# EAGLE design dash-board (EAGLE 4.16)
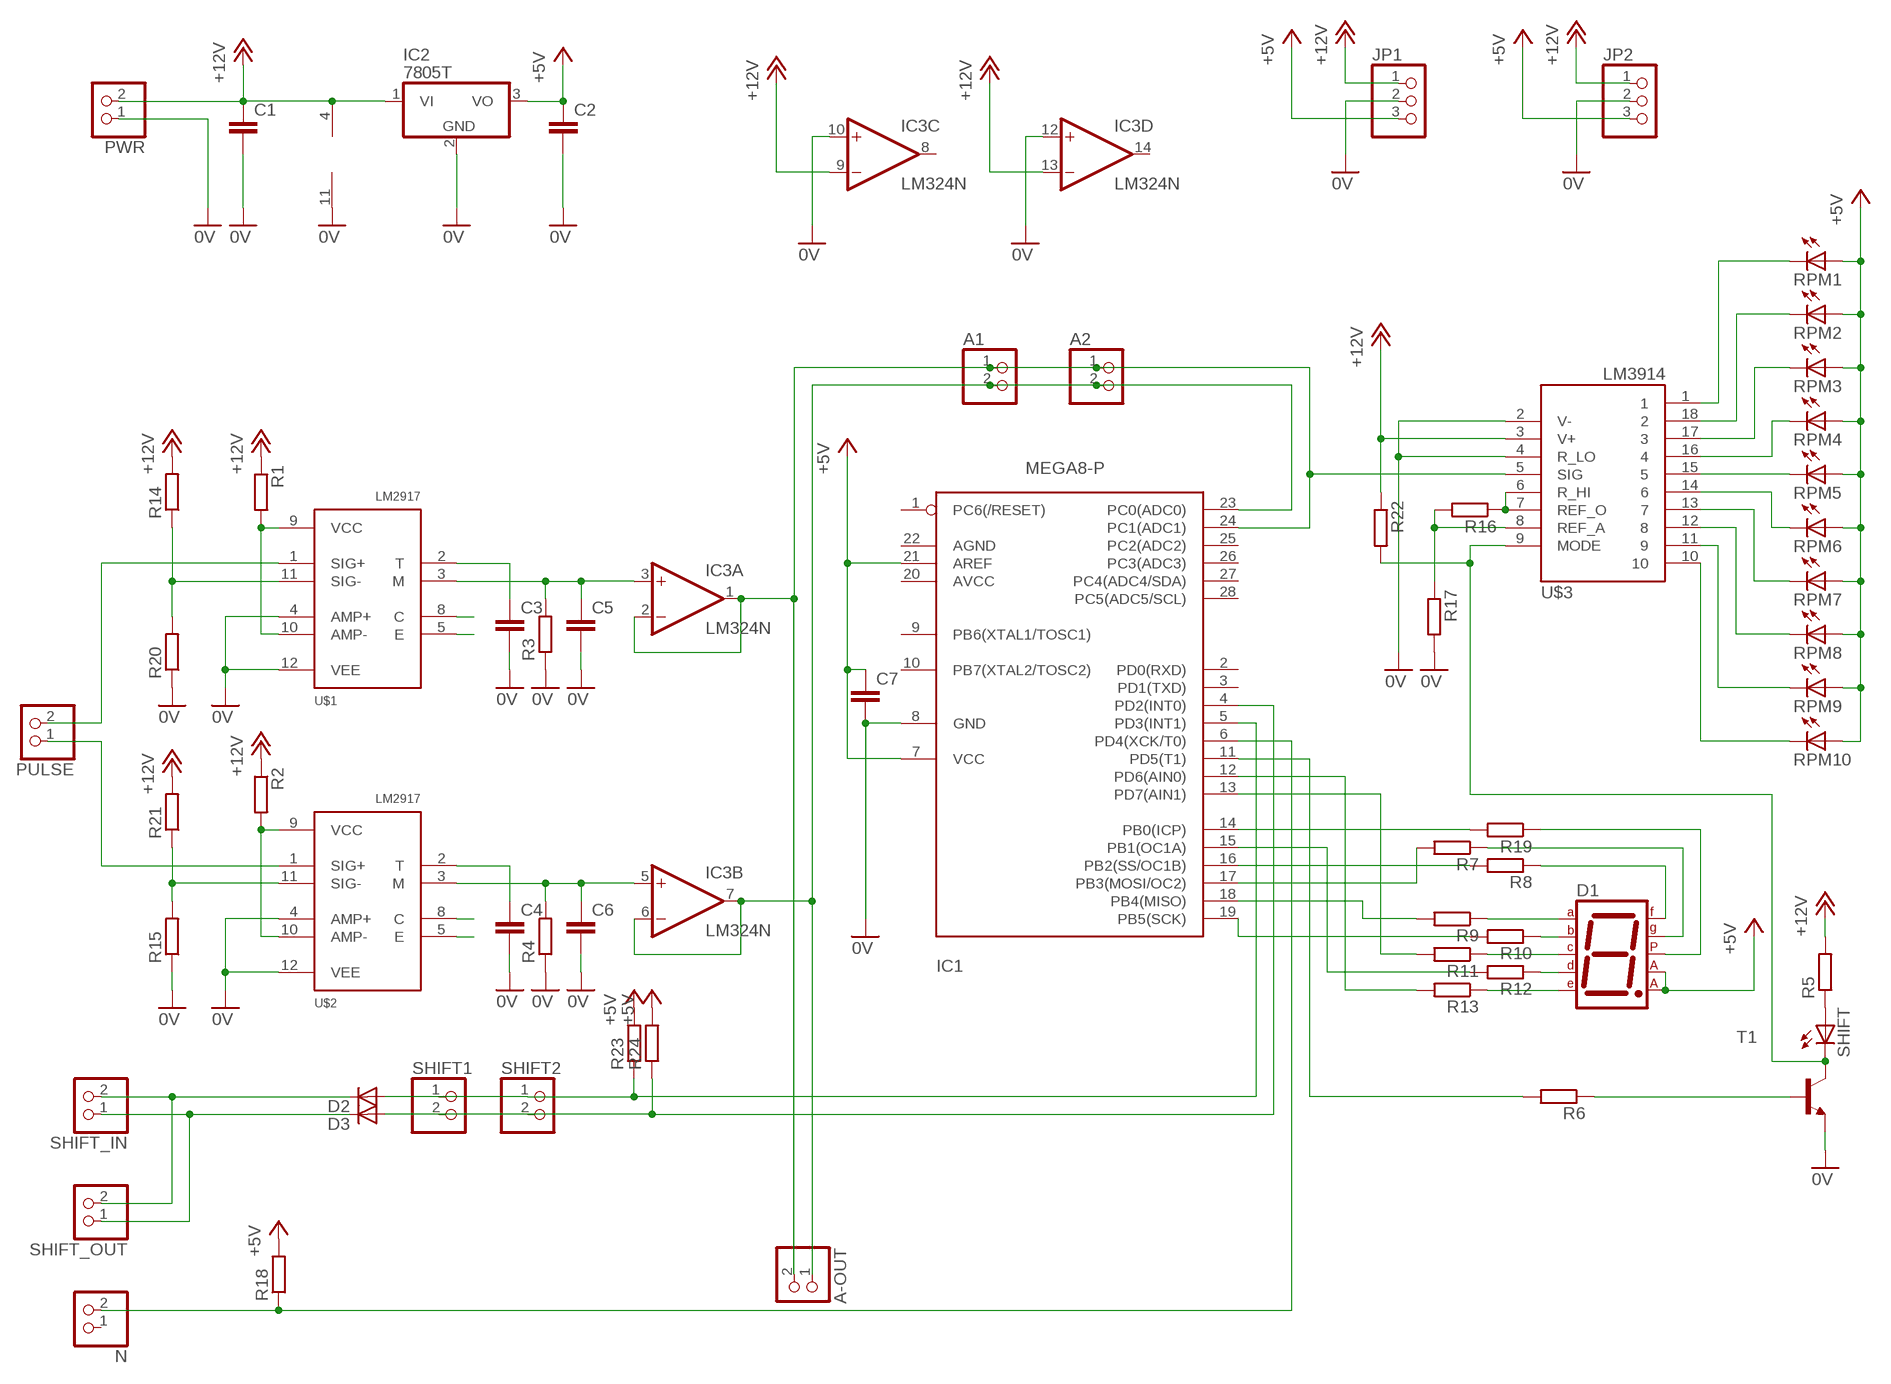
[diagram p0: schematic, sheet 1]

## Parts
A1  PINHD-1X2  [1X02]
A2  PINHD-1X2  [1X02]
A-OUT  PINHD-1X2  [1X02]
C1  C-EU050-025X075  [C050-025X075]
C2  C-EU050-025X075  [C050-025X075]
C3  C-EU050-025X075  [C050-025X075]
C4  C-EU050-025X075  [C050-025X075]
C5  C-EU050-025X075  [C050-025X075]
C6  C-EU050-025X075  [C050-025X075]
C7  C-EU050-025X075  [C050-025X075]
D1  7SEG-CA  [7SEG-13]
D2  DIODE-D-5  [D-5]
D3  DIODE-D-5  [D-5]
IC1  MEGA8-P  [DIL28-3]
IC2  7805T  [TO220H]
IC3  LM324N  [DIL14]
JP1  PINHD-1X3  [1X03]
JP2  PINHD-1X3  [1X03]
N  PINHD-1X2  [1X02]
PULSE  PINHD-1X2  [1X02]
PWR  PINHD-1X2  [1X02]
R1  R-EU_0204/7  [0204/7]
R2  R-EU_0204/7  [0204/7]
R3  R-EU_0204/7  [0204/7]
R4  R-EU_0204/7  [0204/7]
R5  R-EU_0204/7  [0204/7]
R6  R-EU_0204/7  [0204/7]
R7  R-EU_0204/7  [0204/7]
R8  R-EU_0204/7  [0204/7]
R9  R-EU_0204/7  [0204/7]
R10  R-EU_0204/7  [0204/7]
R11  R-EU_0204/7  [0204/7]
R12  R-EU_0204/7  [0204/7]
R13  R-EU_0204/7  [0204/7]
R14  R-EU_0204/7  [0204/7]
R15  R-EU_0204/7  [0204/7]
R16  R-EU_0204/7  [0204/7]
R17  R-EU_0204/7  [0204/7]
R18  R-EU_0204/7  [0204/7]
R19  R-EU_0204/7  [0204/7]
R20  R-EU_0204/7  [0204/7]
R21  R-EU_0204/7  [0204/7]
R22  R-EU_0204/7  [0204/7]
R23  R-EU_0204/7  [0204/7]
R24  R-EU_0204/7  [0204/7]
RPM1  LED3MM  [LED3MM]
RPM2  LED3MM  [LED3MM]
RPM3  LED3MM  [LED3MM]
RPM4  LED3MM  [LED3MM]
RPM5  LED3MM  [LED3MM]
RPM6  LED3MM  [LED3MM]
RPM7  LED3MM  [LED3MM]
RPM8  LED3MM  [LED3MM]
RPM9  LED3MM  [LED3MM]
RPM10  LED3MM  [LED3MM]
SHIFT  LED5MM  [LED5MM]
SHIFT1  PINHD-1X2  [1X02]
SHIFT2  PINHD-1X2  [1X02]
SHIFT_IN  PINHD-1X2  [1X02]
SHIFT_OUT  PINHD-1X2  [1X02]
T1  BC547B-NPN-TO92-EBC  [TO92-EBC]
U$1  LM2917  [DIL14]
U$2  LM2917  [DIL14]
U$3  LM3914  [DIL18]

## Nets
0V: C1.2 C2.2 C3.2 C4.2 C5.2 C6.2 C7.2 IC1.8(GND) IC2.2(GND) IC3.10(C:+IN) IC3.11(P:V-) IC3.12(D:+IN) JP1.2 JP2.2 PWR.1 R3.1 R4.1 R15.1 R17.2 R20.1 T1.E U$1.4(AMP+) U$1.12(VEE) U$2.4(AMP+) U$2.12(VEE) U$3.2(V-) U$3.4(R_LO)
+5V: C2.1 C7.1 D1.3(CA1) D1.8(CA2) IC1.7(VCC) IC1.21(AREF) IC2.3(VO) JP1.3 JP2.3 R18.2 R23.2 R24.2 RPM1.A RPM2.A RPM3.A RPM4.A RPM5.A RPM6.A RPM7.A RPM8.A RPM9.A RPM10.A
+12V: C1.1 IC2.1(VI) IC3.4(P:V+) IC3.9(C:-IN) IC3.13(D:-IN) JP1.1 JP2.1 PWR.2 R1.1 R2.1 R5.2 R14.2 R21.2 R22.1 U$3.3(V+)
N$1: PULSE.2 U$1.1(SIG+)
N$2: R1.2 U$1.9(VCC) U$1.10(AMP-)
N$3: R2.2 U$2.9(VCC) U$2.10(AMP-)
N$4: RPM1.K(C) U$3.1
N$5: RPM2.K(C) U$3.18
N$6: RPM3.K(C) U$3.17
N$7: RPM4.K(C) U$3.16
N$8: RPM5.K(C) U$3.15
N$9: RPM6.K(C) U$3.14
N$10: RPM7.K(C) U$3.13
N$11: RPM8.K(C) U$3.12
N$12: RPM9.K(C) U$3.11
N$13: RPM10.K(C) U$3.10
N$14: C3.1 U$1.2(T)
N$15: C4.1 U$2.2(T)
N$16: C6.1 IC3.5(B:+IN) R4.2 U$2.3(M)
N$17: C5.1 IC3.3(A:+IN) R3.2 U$1.3(M)
N$18: D1.10(G) R7.1
N$19: PULSE.1 U$2.1(SIG+)
N$20: R22.2 SHIFT.K(C) T1.C U$3.9(MODE)
N$21: R5.1 SHIFT.A
N$22: R6.1 T1.B
N$23: U$1.8(C)
N$24: D1.9(F) R8.1
N$25: D1.7(A) R9.1
N$26: D1.6(B) R10.1
N$27: D1.4(C) R11.1
N$28: D1.2(D) R12.1
N$29: D1.1(E) R13.1
N$30: IC1.19(PB5(SCK)) R10.2
N$31: IC1.18(PB4(MISO)) R9.2
N$32: IC1.17(PB3(MOSI/OC2)) R7.2
N$33: IC1.16(PB2(SS/OC1B)) R8.2
N$34: IC1.15(PB1(OC1A)) R12.2
N$35: IC1.12(PD6(AIN0)) R13.2
N$36: IC1.13(PD7(AIN1)) R11.2
N$37: A1.1 A2.1 A-OUT.2 IC1.24(PC1(ADC1)) IC3.1(A:OUT) IC3.2(A:-IN) U$3.5(SIG)
N$38: A1.2 A2.2 A-OUT.1 IC1.23(PC0(ADC0)) IC3.6(B:-IN) IC3.7(B:OUT)
N$39: D2.C SHIFT_IN.2 SHIFT_OUT.2
N$40: D3.A IC1.4(PD2(INT0)) R24.1 SHIFT1.2 SHIFT2.2
N$41: IC1.11(PD5(T1)) R6.2
N$42: R14.1 R20.2 U$1.11(SIG-)
N$43: R16.1 U$3.6(R_HI) U$3.7(REF_O)
N$44: R16.2 R17.1 U$3.8(REF_A)
N$45: D1.5(DP) R19.1
N$46: IC1.14(PB0(ICP)) R19.2
N$47: IC1.6(PD4(XCK/T0)) N.2 R18.1
N$50: U$2.8(C)
N$51: U$2.5(E)
N$52: U$1.5(E)
N$53: R15.2 R21.1 U$2.11(SIG-)
N$65: D2.A IC1.5(PD3(INT1)) R23.1 SHIFT1.1 SHIFT2.1
N$67: SHIFT_IN.1 SHIFT_OUT.1
Unconnected: D3.C IC1.1(PC6(/RESET)) IC1.2(PD0(RXD)) IC1.3(PD1(TXD)) IC1.9(PB6(XTAL1/TOSC1)) IC1.10(PB7(XTAL2/TOSC2)) IC1.20(AVCC) IC1.22(AGND) IC1.25(PC2(ADC2)) IC1.26(PC3(ADC3)) IC1.27(PC4(ADC4/SDA)) IC1.28(PC5(ADC5/SCL)) IC3.8(C:OUT) IC3.14(D:OUT) N.1

## Library data of the parts
A1 A2 A-OUT N PULSE PWR SHIFT1 SHIFT2 SHIFT_IN SHIFT_OUT = pinhead:PINHD-1X2: PIN HEADER
C1-C7 = rcl:C-EU: CAPACITOR, European symbol
D1 = special:7SEG-CA: 7-segment DISPLAY single anode, 13 mm
D2 D3 = diode:DIODE-: DIODE
IC1 = atmel:MEGA8-P: MICROCONTROLLER 8 Kbytes FLASH 1 kbytes SRAM 512 bytes EEPROM USART 4-channel 10 bit ADC 2-channel 8 bit ADC Source: avr.lbr
IC2 = linear:78*: Positive VOLTAGE REGULATOR Source: http://cache.national.com/ds/LM/LM78L05.pdf http://www.fairchildsemi.com/ds/LM/LM7805.pdf
IC3 = linear:LM324: OP AMP
JP1 JP2 = pinhead:PINHD-1X3: PIN HEADER
R1-R24 = rcl:R-EU_: RESISTOR, European symbol
RPM1-RPM10 SHIFT = led:LED: LED OSRAM: - CHIPLED LG R971, LG N971, LY N971, LG Q971, LY Q971, LO R971, LY R971 LH N974, LH R974 LS Q976, LO Q976, LY Q976 LO Q996 - Hyper CHIPLED LW Q18S LB Q993, LB Q99A, LB R99A - SideLED LS A670, LO A670, LY A670, LG A670, LP A670 LB A673, LV A673, LT A673, LW A673 LH A674 LY A675 LS A676, LA A676, LO A676, LY A676, LW A676 LS A679, LY A679, LG A679 - Hyper Micro SIDELED® LS Y876, LA Y876, LO Y876, LY Y876 LT Y87S - SmartLED LW L88C, LW L88S LB L89C, LB L89S, LG L890 LS L89K, LO L89K, LY L89K LS L896, LA L896, LO L896, LY L896 - TOPLED LS T670, LO T670, LY T670, LG T670, LP T670 LSG T670, LSP T670, LSY T670, LOP T670, LYG T670 LG T671, LOG T671, LSG T671 LB T673, LV T673, LT T673, LW T673 LH T674 LS T676, LA T676, LO T676, LY T676, LB T676, LH T676, LSB T676, LW T676 LB T67C, LV T67C, LT T67C, LS T67K, LO T67K, LY T67K, LW E67C LS E67B, LA E67B, LO E67B, LY E67B, LB E67C, LV E67C, LT E67C LW T67C LS T679, LY T679, LG T679 LS T770, LO T770, LY T770, LG T770, LP T770 LB T773, LV T773, LT T773, LW T773 LH T774 LS E675, LA E675, LY E675, LS T675 LS T776, LA T776, LO T776, LY T776, LB T776 LHGB T686 LT T68C, LB T68C - Hyper Mini TOPLED® LB M676 - Mini TOPLED Santana® LG M470 LS M47K, LO M47K, LY M47K Source: http://www.osram.convergy.de/
T1 = transistor:*-NPN-: NPN Transistror
U$1 U$2 = rnie04:LM2917
U$3 = rnie04:LM3914

## Board
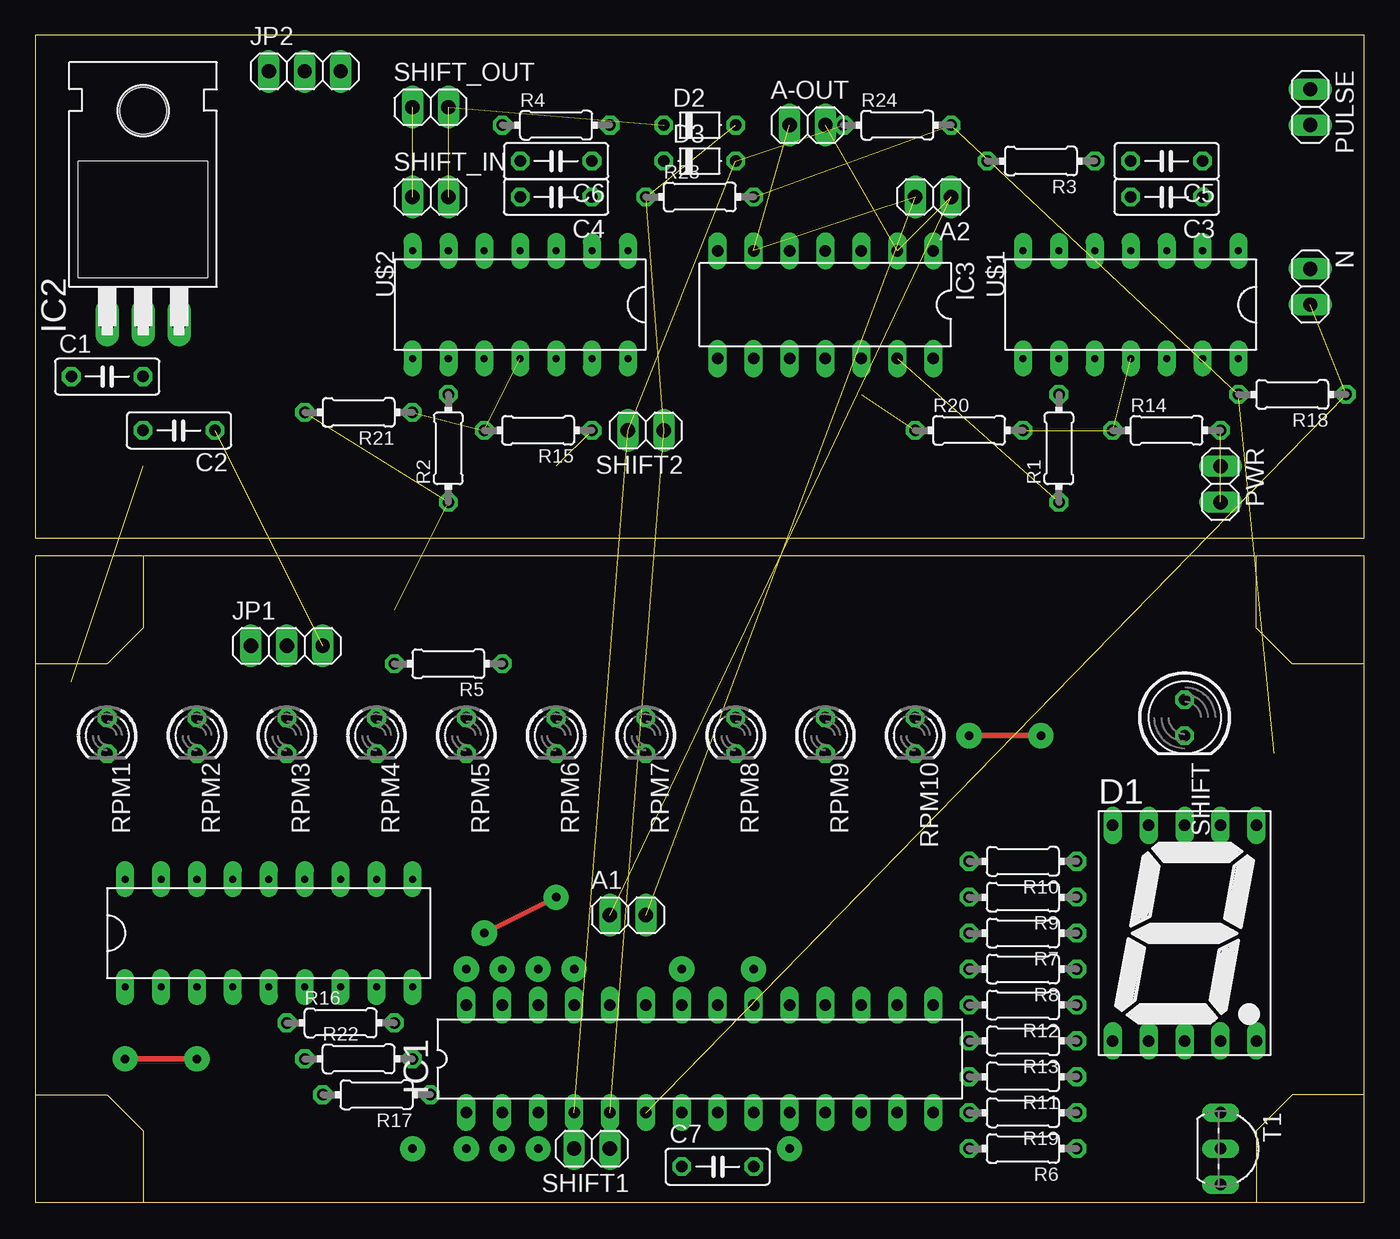
[diagram p1: board, top side]
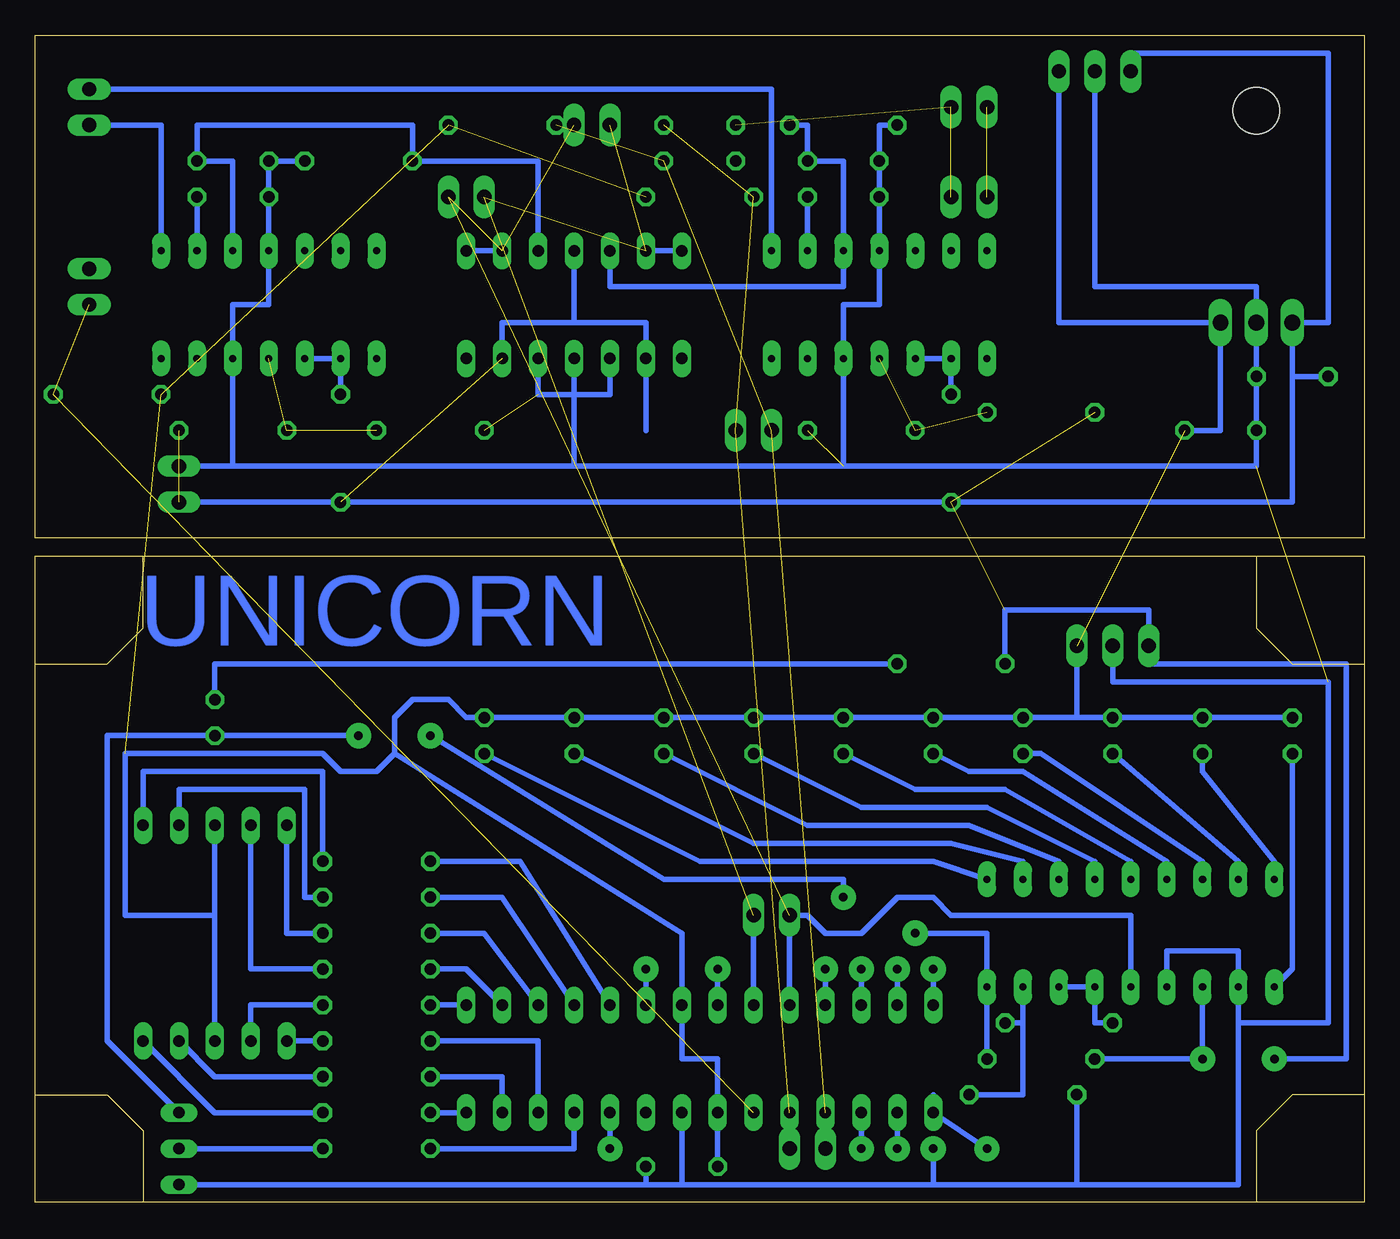
[diagram p2: board, bottom side, seen from below]

Size 93.98 x 82.55 mm. Coordinates in mm from the lower left corner, seen from the top.
Outline: 7.62,0 0,0 0,7.62
Outline: 7.62,0 86.36,0
Outline: 86.36,0 93.98,0 93.98,7.62
Outline: 93.98,7.62 93.98,38.1
Outline: 93.98,38.1 93.98,45.72 86.36,45.72
Outline: 86.36,45.72 7.62,45.72
Outline: 7.62,45.72 0,45.72 0,38.1
Outline: 0,38.1 0,7.62
Outline: 93.98,38.1 88.9,38.1 86.36,40.64 86.36,45.72
Outline: 93.98,7.62 88.9,7.62 86.36,5.08 86.36,0
Outline: 0,7.62 5.08,7.62 7.62,5.08 7.62,0
Outline: 7.62,45.72 7.62,40.64 5.08,38.1 0,38.1
Outline: 0,46.99 93.98,46.99 93.98,82.55 0,82.55 0,46.99
Copper layers (1*16): Top 0.035mm / dielectric 1.5mm / Bottom 0.035mm
Design rules "default": minimum track width 10mil, minimum drill 24mil, track to track 8mil, track to pad 8mil, pad to pad 8mil, via to via 8mil, smd to smd 8mil, copper to edge 40mil, drill to drill 8mil, minimum pad ring 10mil, minimum via ring 8mil, stop-mask expansion 4mil, vias tented up to drill 0mil, thermal gap 10mil
tKeepout: area 0,0 to 7.6,7.6; area 86.4,0 to 94,7.6; area 86.4,38.1 to 94,45.7; area 0,38.1 to 7.6,45.7; area 86.4,47 to 94,54.6; area 0,47 to 7.6,54.6

### Footprints (pad centres in the part's own frame; a part is rotated, then mirrored left to right if it is on the bottom)
1X02 = drill 1.016 long: 1 -1.27,0; 2 1.27,0
C050-025X075 = drill 0.813 octagon: 1 -2.54,0; 2 2.54,0
7SEG-13 = drill 0.813 long: 1 -5.08,-7.62; 2 -2.54,-7.62; 3 0,-7.62; 4 2.54,-7.62; 5 5.08,-7.62; 6 5.08,7.62; 7 2.54,7.62; 8 0,7.62; 9 -2.54,7.62; 10 -5.08,7.62
D-5 = drill 0.813 octagon: A 2.54,0; C -2.54,0
DIL28-3 = drill 0.813 long: 1 -16.51,-3.81; 2 -13.97,-3.81; 3 -11.43,-3.81; 4 -8.89,-3.81; 5 -6.35,-3.81; 6 -3.81,-3.81; 7 -1.27,-3.81; 8 1.27,-3.81; 9 3.81,-3.81; 10 6.35,-3.81; 11 8.89,-3.81; 12 11.43,-3.81; 13 13.97,-3.81; 14 16.51,-3.81; 15 16.51,3.81; 16 13.97,3.81; 17 11.43,3.81; 18 8.89,3.81; 19 6.35,3.81; 20 3.81,3.81; 21 1.27,3.81; 22 -1.27,3.81; 23 -3.81,3.81; 24 -6.35,3.81; 25 -8.89,3.81; 26 -11.43,3.81; 27 -13.97,3.81; 28 -16.51,3.81
TO220H = drill 1.118 long: 1 -2.54,-10.16; 2 0,-10.16; 3 2.54,-10.16 | hole 3.302: 0,4.826
DIL14 = drill 0.813 long: 1 -7.62,-3.81; 2 -5.08,-3.81; 3 -2.54,-3.81; 4 0,-3.81; 5 2.54,-3.81; 6 5.08,-3.81; 7 7.62,-3.81; 8 7.62,3.81; 9 5.08,3.81; 10 2.54,3.81; 11 0,3.81; 12 -2.54,3.81; 13 -5.08,3.81; 14 -7.62,3.81
1X03 = drill 1.016 long: 1 -2.54,0; 2 0,0; 3 2.54,0
0204/7 = drill 0.813 octagon: 1 -3.81,0; 2 3.81,0
LED3MM = drill 0.813 octagon: A -1.27,0; K 1.27,0
LED5MM = drill 0.813 octagon: A -1.27,0; K 1.27,0
TO92-EBC = drill 0.813 long: B 0,-1.27; C -2.54,-1.27; E 2.54,-1.27
DIL14' = drill 0.5 pad 1.27 long: 1 -3.81,7.62; 2 -3.81,5.08; 3 -3.81,2.54; 4 -3.81,0; 5 -3.81,-2.54; 6 -3.81,-5.08; 7 -3.81,-7.62; 8 3.81,-7.62; 9 3.81,-5.08; 10 3.81,-2.54; 11 3.81,0; 12 3.81,2.54; 13 3.81,5.08; 14 3.81,7.62
DIL18 = drill 0.5 pad 1.27 long: 1 -3.81,11.43; 2 -3.81,8.89; 3 -3.81,6.35; 4 -3.81,3.81; 5 -3.81,1.27; 6 -3.81,-1.27; 7 -3.81,-3.81; 8 -3.81,-6.35; 9 -3.81,-8.89; 10 3.81,-8.89; 11 3.81,-6.35; 12 3.81,-3.81; 13 3.81,-1.27; 14 3.81,1.27; 15 3.81,3.81; 16 3.81,6.35; 17 3.81,8.89; 18 3.81,11.43

### Placement (x,y rotation side)
A1  41.91,20.32 0 top
A2  63.5,71.12 180 top
A-OUT  54.61,76.2 0 top
C1  5.08,58.42 0 top
C2  10.16,54.61 180 top
C3  80.01,71.12 180 top
C4  36.83,71.12 180 top
C5  80.01,73.66 180 top
C6  36.83,73.66 180 top
C7  48.26,2.54 0 top
D1  81.28,19.05 0 top
D2  46.99,76.2 0 top
D3  46.99,73.66 0 top
IC1  46.99,10.16 0 top
IC2  7.62,72.39 0 top
IC3  55.88,63.5 180 top
JP1  17.78,39.37 0 top
JP2  19.05,80.01 0 top
N  90.17,64.77 270 top
PULSE  90.17,77.47 270 top
PWR  83.82,50.8 270 top
R1  72.39,53.34 90 top
R2  29.21,53.34 90 top
R3  71.12,73.66 180 top
R4  36.83,76.2 0 top
R5  29.21,38.1 180 top
R6  69.85,3.81 180 top
R7  69.85,19.05 180 top
R8  69.85,16.51 180 top
R9  69.85,21.59 180 top
R10  69.85,24.13 180 top
R11  69.85,8.89 180 top
R12  69.85,13.97 180 top
R13  69.85,11.43 180 top
R14  80.01,54.61 0 top
R15  35.56,54.61 180 top
R16  21.59,12.7 0 top
R17  24.13,7.62 180 top
R18  88.9,57.15 180 top
R19  69.85,6.35 180 top
R20  66.04,54.61 0 top
R21  22.86,55.88 180 top
R22  22.86,10.16 0 top
R23  46.99,71.12 0 top
R24  60.96,76.2 0 top
RPM1  5.08,33.02 270 top
RPM2  11.43,33.02 270 top
RPM3  17.78,33.02 270 top
RPM4  24.13,33.02 270 top
RPM5  30.48,33.02 270 top
RPM6  36.83,33.02 270 top
RPM7  43.18,33.02 270 top
RPM8  49.53,33.02 270 top
RPM9  55.88,33.02 270 top
RPM10  62.23,33.02 270 top
SHIFT  81.28,34.29 270 top
SHIFT1  39.37,3.81 180 top
SHIFT2  43.18,54.61 180 top
SHIFT_IN  27.94,71.12 0 top
SHIFT_OUT  27.94,77.47 0 top
T1  85.09,3.81 270 top
U$1  LM2917  [DIL14']  77.47,63.5 270 top
U$2  LM2917  [DIL14']  34.29,63.5 270 top
U$3  17.78,19.05 90 top

### Tracks (layer width: path | path; a pad name or v marks a point on that pad's centre or on a via)
0V  (via drill 0.6 pad 1.78)  (3 unrouted)
  Bottom 0.406: 8.89,12.7 U$3.2 8.89,17.78 13.97,17.78 U$3.4 | 20.32,1.27 30.48,1.27 | 30.48,1.27 48.26,1.27 | 48.26,1.27 IC1.8 | 80.01,52.07 U$1.12 80.01,63.5 77.47,63.5 U$1.4 C3.2 C5.2 R3.1 | 80.01,52.07 PWR.1 | 36.83,52.07 55.88,52.07 | 55.88,52.07 80.01,52.07 | 36.83,52.07 U$2.12 36.83,63.5 34.29,63.5 U$2.4 C4.2 C6.2 34.29,76.2 R4.1 | 55.88,52.07 IC3.11 55.88,57.15 | 55.88,57.15 53.34,57.15 IC3.10 | IC3.12 58.42,57.15 55.88,57.15 | 36.83,52.07 7.62,52.07 C2.2 | C2.2 C1.2 | C1.2 IC2.2 7.62,64.77 19.05,64.77 JP2.2 | C2.2 C1.2 | JP1.2 17.78,36.83 2.54,36.83 2.54,12.7 8.89,12.7 | 48.26,1.27 50.8,1.27 | 50.8,1.27 T1.E | 50.8,1.27 C7.2 | 8.89,12.7 8.89,1.27 20.32,1.27 | 20.32,1.27 R17.2 | 30.48,1.27 v30.48,3.81
+5V  (4 unrouted)
  Bottom 0.406: RPM1.A RPM2.A 20.32,34.29 | RPM5.A RPM4.A 20.32,34.29 | RPM5.A RPM6.A | RPM6.A RPM7.A | RPM7.A RPM8.A | RPM8.A RPM9.A | RPM9.A RPM10.A 63.5,34.29 64.77,35.56 67.31,35.56 68.58,34.29 68.58,31.75 | IC1.7 45.72,10.16 48.26,10.16 IC1.21 48.26,19.05 68.58,31.75 | IC1.7 C7.1 IC1.7 | C2.1 10.16,54.61 IC2.3 21.59,62.23 JP2.3 | 20.32,34.29 JP1.3 | RPM8.A RPM9.A | RPM7.A RPM8.A | RPM6.A RPM7.A | RPM5.A RPM6.A | 20.32,34.29 RPM3.A | 81.28,20.32 D1.3 | 81.28,20.32 D1.8 | 68.58,31.75 69.85,30.48 72.39,30.48 73.66,31.75 87.63,31.75 87.63,20.32 81.28,20.32
+12V  (via drill 0.6 pad 1.78)  (4 unrouted)
  Top 0.406: v6.35,10.16 v11.43,10.16
  Bottom 0.406: U$3.3 v11.43,10.16 R22.1 | R1.1 R2.1 5.08,49.53 5.08,58.42 | R1.1 PWR.2 R1.1 | 50.8,54.61 IC3.9 50.8,62.23 55.88,62.23 | 55.88,62.23 IC3.4 | IC3.13 60.96,62.23 55.88,62.23 | 5.08,58.42 IC2.1 2.54,62.23 2.54,81.28 16.51,81.28 JP2.1 | 5.08,58.42 C1.1 | v6.35,10.16 1.27,10.16 1.27,38.1 15.24,38.1 JP1.1 15.24,41.91 25.4,41.91 R5.2
N$1
  Bottom 0.406: PULSE.2 85.09,76.2 U$1.1
N$2
  Bottom 0.406: U$1.10 U$1.9 R1.2
N$3
  Bottom 0.406: U$2.10 U$2.9 R2.2
N$4
  Bottom 0.406: RPM1.K 5.08,16.51 U$3.1
N$5
  Bottom 0.406: U$3.18 6.35,24.13 11.43,30.48 RPM2.K
N$6
  Bottom 0.406: U$3.17 8.89,24.13 RPM3.K
N$7
  Bottom 0.406: U$3.16 11.43,24.13 22.86,31.75 RPM4.K
N$8
  Bottom 0.406: U$3.15 13.97,24.13 24.13,30.48 27.94,30.48 RPM5.K
N$9
  Bottom 0.406: U$3.14 16.51,24.13 25.4,29.21 31.75,29.21 RPM6.K
N$10
  Bottom 0.406: U$3.13 19.05,24.13 26.67,27.94 35.56,27.94 RPM7.K
N$11
  Bottom 0.406: U$3.12 21.59,24.13 27.94,26.67 39.37,26.67 RPM8.K
N$12
  Bottom 0.406: U$3.11 24.13,24.13 29.21,25.4 43.18,25.4 RPM9.K
N$13
  Bottom 0.406: U$3.10 30.48,24.13 46.99,24.13 RPM10.K
N$14
  Bottom 0.406: U$1.2 C3.1
N$15
  Bottom 0.406: U$2.2 C4.1
N$16
  Bottom 0.406: R4.2 39.37,76.2 C6.1 36.83,73.66 U$2.3 36.83,64.77 53.34,64.77 IC3.5
N$17
  Bottom 0.406: U$1.3 80.01,73.66 C5.1 82.55,76.2 67.31,76.2 R3.2 58.42,73.66 IC3.3
N$18
  Bottom 0.406: R7.1 76.2,19.05 D1.10
N$19
  Bottom 0.406: U$2.1 41.91,78.74 PULSE.1
N$20  (via drill 0.6 pad 1.78)
  Top 0.406: v31.75,19.05 v36.83,21.59 | v71.12,33.02 v66.04,33.02
  Bottom 0.406: T1.C 88.9,11.43 88.9,33.02 SHIFT.K v71.12,33.02 | U$3.9 R22.2 26.67,19.05 v31.75,19.05 | v36.83,21.59 36.83,22.86 49.53,22.86 v66.04,33.02
N$21
  Bottom 0.406: R5.1 81.28,38.1 SHIFT.A
N$22
  Bottom 0.406: R6.1 T1.B
N$24
  Bottom 0.406: R8.1 78.74,16.51 D1.9
N$25
  Bottom 0.406: D1.7 83.82,29.21 74.93,29.21 74.93,21.59 R9.1
N$26
  Bottom 0.406: D1.6 86.36,30.48 73.66,30.48 R10.1
N$27
  Bottom 0.406: R11.1 81.28,8.89 D1.4
N$28
  Bottom 0.406: R12.1 78.74,13.97 D1.2
N$29
  Bottom 0.406: R13.1 D1.1
N$30
  Bottom 0.406: IC1.19 59.69,24.13 R10.2
N$31
  Bottom 0.406: IC1.18 60.96,21.59 R9.2
N$32
  Bottom 0.406: IC1.17 62.23,19.05 R7.2
N$33
  Bottom 0.406: IC1.16 63.5,16.51 R8.2
N$34
  Bottom 0.406: IC1.15 R12.2
N$35
  Bottom 0.406: R13.2 58.42,11.43 IC1.12
N$36
  Bottom 0.406: IC1.13 60.96,8.89 R11.2
N$37  (3 unrouted)
  Bottom 0.406: U$3.5 16.51,20.32 29.21,20.32 30.48,21.59 33.02,21.59 35.56,19.05 38.1,19.05 39.37,20.32 A1.1 IC1.24 | IC3.2 IC3.1
N$38  (3 unrouted)
  Bottom 0.406: IC3.7 IC3.6 | IC1.23 A1.2
N$39  (2 unrouted)
N$40  (3 unrouted)
  Bottom 0.406: SHIFT1.2 IC1.4
N$41
  Bottom 0.406: IC1.11 55.88,3.81 R6.2
N$42  (2 unrouted)
N$43
  Bottom 0.406: U$3.6 U$3.7 U$3.6 | R16.1 19.05,12.7 U$3.6
N$44
  Bottom 0.406: R17.1 24.13,7.62 24.13,12.7 | 24.13,12.7 R16.2 | 24.13,12.7 U$3.8
N$45
  Bottom 0.406: R19.1 81.28,6.35 D1.5
N$46
  Bottom 0.406: IC1.14 R19.2
N$47  (2 unrouted)
N$53  (2 unrouted)
N$54  (via drill 0.6 pad 1.78)
  Bottom 0.406: v50.8,16.51 50.8,15.24
N$55  (via drill 0.6 pad 1.78)
  Bottom 0.406: v45.72,16.51 45.72,15.24
N$56  (via drill 0.6 pad 1.78)
  Bottom 0.406: v30.48,16.51 30.48,15.24
N$57  (via drill 0.6 pad 1.78)
  Bottom 0.406: v33.02,16.51 33.02,15.24
N$58  (via drill 0.6 pad 1.78)
  Bottom 0.406: v35.56,16.51 35.56,15.24
N$59  (via drill 0.6 pad 1.78)
  Bottom 0.406: v38.1,16.51 38.1,15.24
N$60  (via drill 0.6 pad 1.78)
  Bottom 0.406: v26.67,3.81 30.48,6.35 30.48,7.62
N$61  (via drill 0.6 pad 1.78)
  Bottom 0.406: v33.02,3.81 33.02,5.08
N$62  (via drill 0.6 pad 1.78)
  Bottom 0.406: v35.56,3.81 35.56,5.08
N$63  (via drill 0.6 pad 1.78)
  Bottom 0.406: v53.34,3.81 53.34,5.08
N$65  (3 unrouted)
  Bottom 0.406: SHIFT1.1 IC1.5
N$67  (1 unrouted)

### Text on the board
Bottom: UNICORN